# EAGLE design PCB1a (EAGLE 9.6.2)

## Sheet 1 of 3
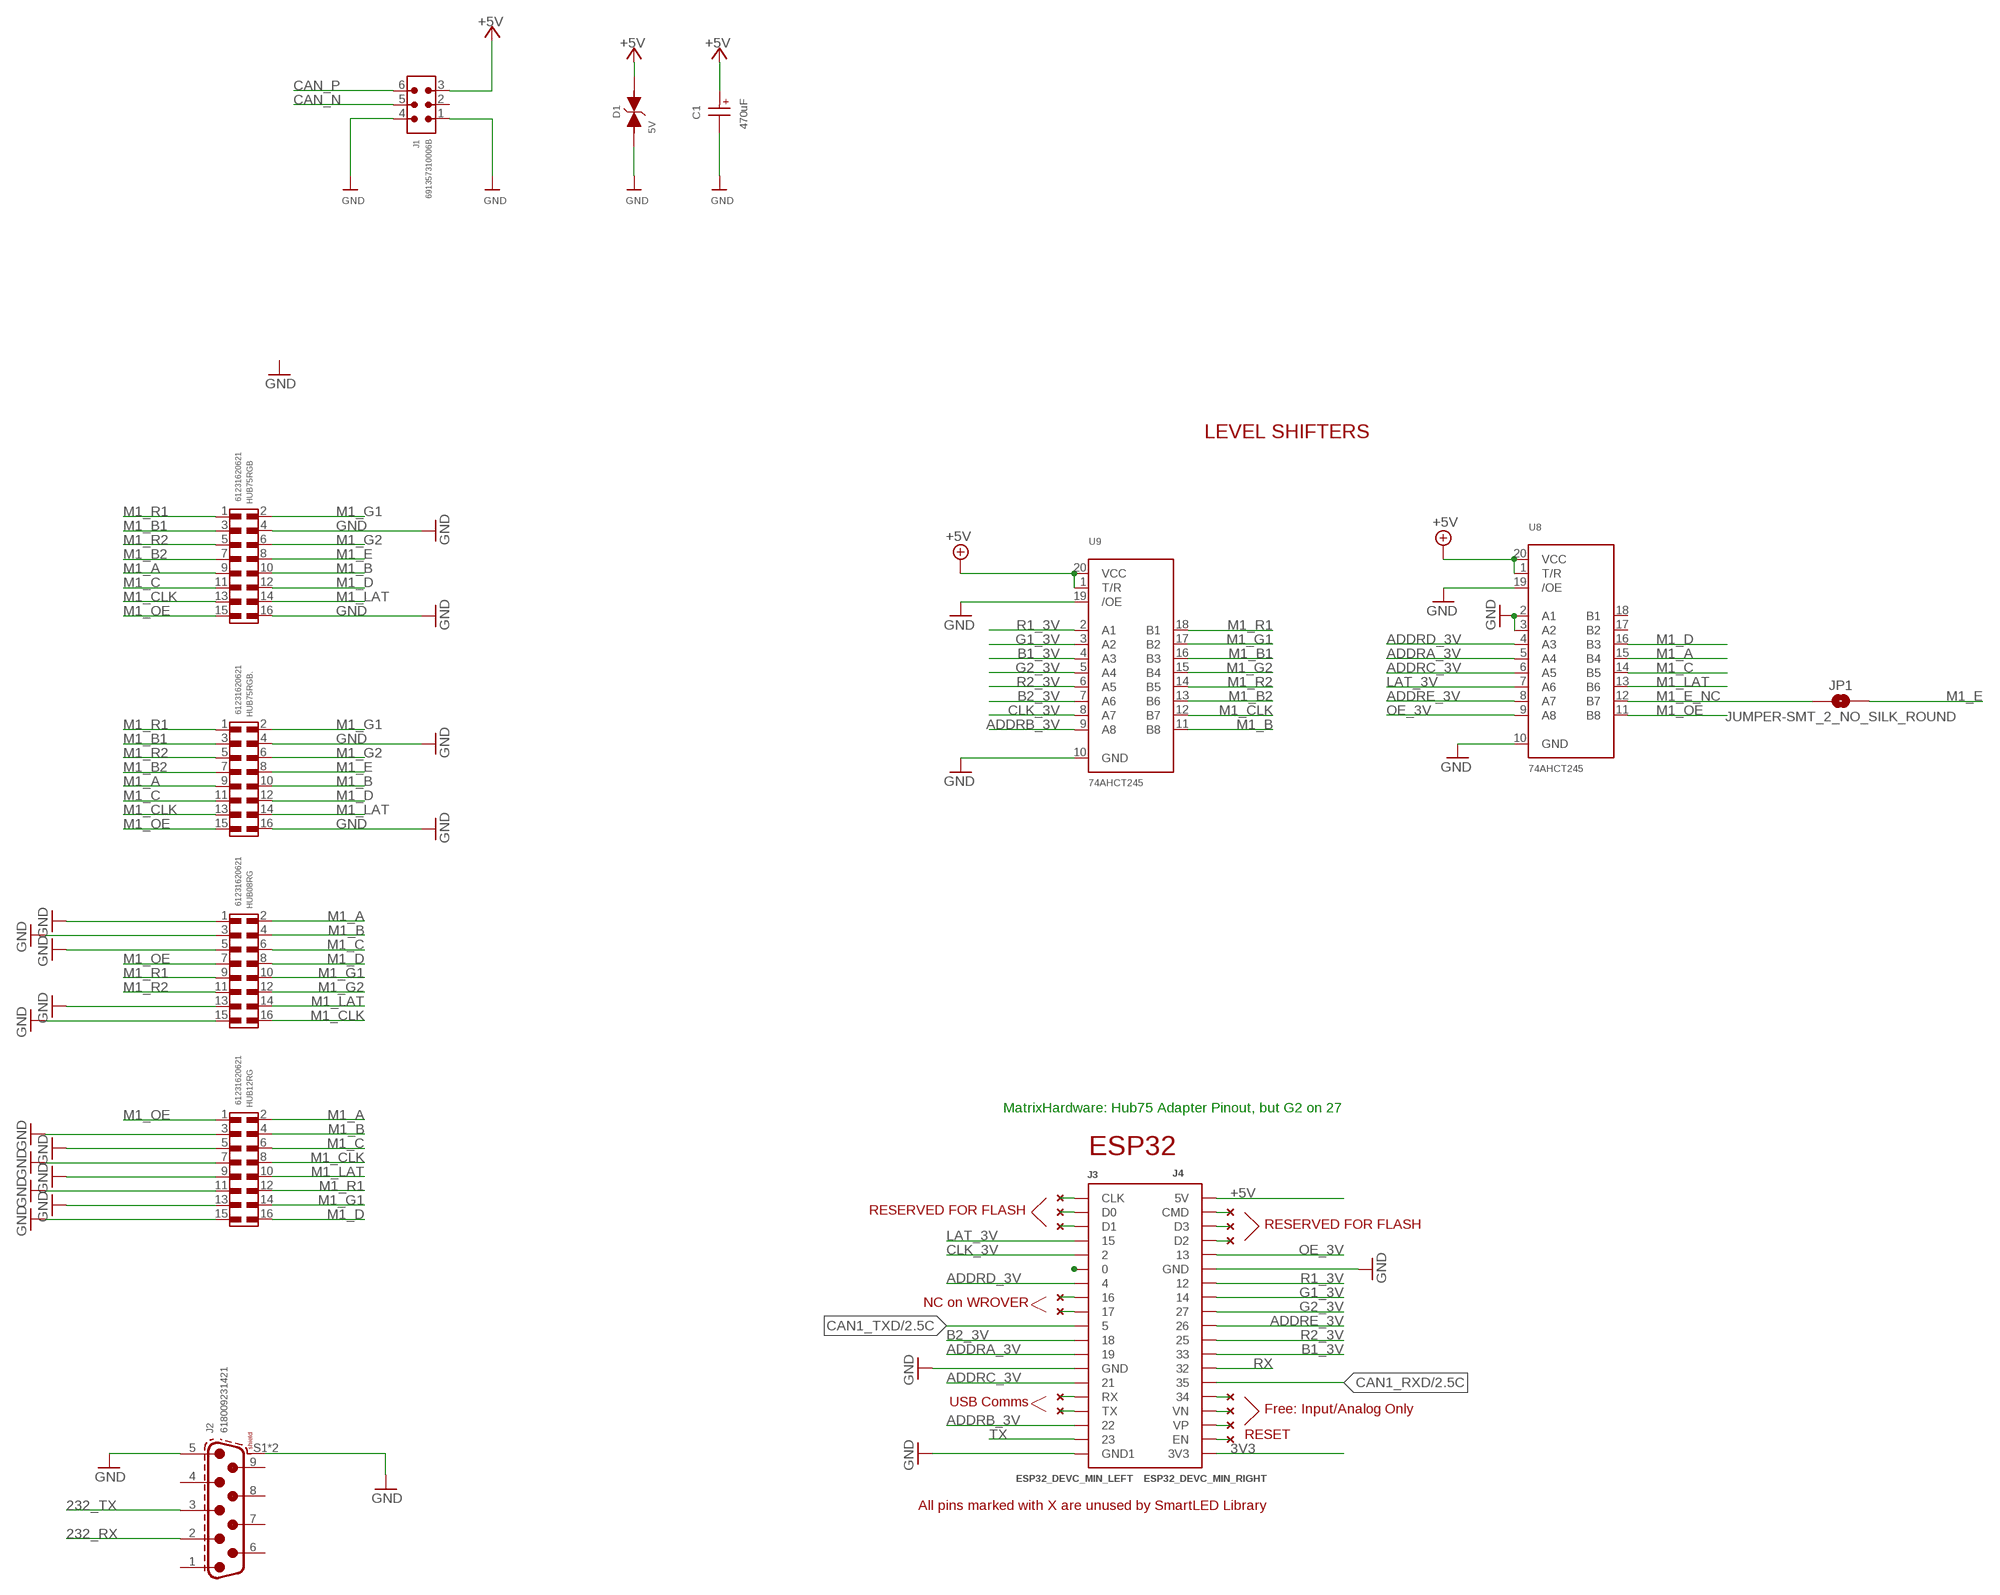
[diagram p0: schematic, sheet 1]

### Parts
C1  470uF  WCAP-AS5H_10X10.5_865230357008  [WCAP-AS5H_10X10.5(DXL)]
D1  5V  WE-TVSP_DO-214AB_3000W_BI_824551500  [WE-TVSP_DO-214AB_BIDIRECTIONAL]
HUB08RG  61231620621  6123XX20621_61231620621  [61231620621]
HUB12RG  61231620621  6123XX20621_61231620621  [61231620621]
HUB75RGB  61231620621  6123XX20621_61231620621  [61231620621]
HUB75RGB.  61231620621  6123XX20621_61231620621  [61231620621]
J1  691357310006B  [691357310006B]
J2  618009231421  6180XX231421_618009231421  [618009231421]
J3  ESP32_DEVC_MIN_LEFT  [ESP32_DEVC_DUAL_HEADER_BOT_MOUNT_LEFT]
J4  ESP32_DEVC_MIN_RIGHT  [ESP32_DEVC_DUAL_HEADER_BOT_MOUNT_RIGHT]
JP1  JUMPER-SMT_2_NO_SILK_ROUND  [SMT-JUMPER_2_NO_SILK_ROUND]
U8  74AHCT245  74LCX245_TSSOP20  [TSSOP20]
U9  74AHCT245  74LCX245_TSSOP20  [TSSOP20]
U$2  NC  (no package)
U$3  NC  (no package)
U$4  NC  (no package)
U$5  NC  (no package)
U$6  NC  (no package)
U$7  NC  (no package)
U$8  NC  (no package)
U$9  NC  (no package)
U$10  NC  (no package)
U$11  NC  (no package)
U$13  NC  (no package)
U$15  NC  (no package)
U$16  NC  (no package)
U$17  NC  (no package)

### Nets
3V3 [power]: J4.3V3A(3V3) J4.3V3B(3V3)
232_RX: J2.2 ; also sheet 3
232_TX: J2.3 ; also sheet 3
+5V [usbvcc]: C1.1(+) D1.2 J1.3 J4.5V_A(5V) J4.5V_B(5V) U8.1(T/R) U8.20(VCC) U9.1(T/R) U9.20(VCC) ; also sheet 2
ADDRA_3V: J3.19A_A J3.19B_B U8.5(A4)
ADDRB_3V: J3.22A J3.22B U9.9(A8)
ADDRC_3V: J3.21A J3.21B U8.6(A5)
ADDRD_3V: J3.4A J3.4B U8.4(A3)
ADDRE_3V: J4.26A J4.26B U8.8(A7)
B1_3V: J4.33A J4.33B U9.4(A3)
B2_3V: J3.18A_A J3.18B_B U9.7(A6)
CAN1_RXD: J4.35A J4.35B ; also sheet 2
CAN1_TXD: J3.5A J3.5B ; also sheet 2
CAN_N: J1.5 ; also sheet 2
CAN_P: J1.6 ; also sheet 2
CLK_3V: J3.2A J3.2B U9.8(A7)
G1_3V: J4.14A_A J4.14B_B U9.3(A2)
G2_3V: J4.27A J4.27B U9.5(A4)
GND: C1.2(-) D1.1 HUB08RG.1 HUB08RG.3 HUB08RG.5 HUB08RG.13 HUB08RG.15 HUB12RG.3 HUB12RG.5 HUB12RG.7 HUB12RG.9 HUB12RG.11 HUB12RG.13 HUB12RG.15 HUB75RGB.4 HUB75RGB.16 HUB75RGB..4 HUB75RGB..16 J1.1 J1.4 J2.5 J2.S1(SHIELD) J2.S2(SHIELD) J3.GND1A(GND1) J3.GND1B(GND1) J3.GNDA(GND) J3.GNDB(GND) J4.GNDA(GND) J4.GNDB(GND) U8.2(A1) U8.3(A2) U8.10(GND) U8.19(/OE) U9.10(GND) U9.19(/OE) ; also sheet 2,3
LAT_3V: J3.15A_A J3.15B_B U8.7(A6)
M1_A: HUB08RG.2 HUB12RG.2 HUB75RGB.9 HUB75RGB..9 U8.15(B4)
M1_B: HUB08RG.4 HUB12RG.4 HUB75RGB.10 HUB75RGB..10 U9.11(B8)
M1_B1: HUB75RGB.3 HUB75RGB..3 U9.16(B3)
M1_B2: HUB75RGB.7 HUB75RGB..7 U9.13(B6)
M1_C: HUB08RG.6 HUB12RG.6 HUB75RGB.11 HUB75RGB..11 U8.14(B5)
M1_CLK: HUB08RG.16 HUB12RG.8 HUB75RGB.13 HUB75RGB..13 U9.12(B7)
M1_D: HUB08RG.8 HUB12RG.16 HUB75RGB.12 HUB75RGB..12 U8.16(B3)
M1_E: HUB75RGB.8 HUB75RGB..8 JP1.2
M1_E_NC: JP1.1 U8.12(B7)
M1_G1: HUB08RG.10 HUB12RG.14 HUB75RGB.2 HUB75RGB..2 U9.17(B2)
M1_G2: HUB08RG.12 HUB75RGB.6 HUB75RGB..6 U9.15(B4)
M1_LAT: HUB08RG.14 HUB12RG.10 HUB75RGB.14 HUB75RGB..14 U8.13(B6)
M1_OE: HUB08RG.7 HUB12RG.1 HUB75RGB.15 HUB75RGB..15 U8.11(B8)
M1_R1: HUB08RG.9 HUB12RG.12 HUB75RGB.1 HUB75RGB..1 U9.18(B1)
M1_R2: HUB08RG.11 HUB75RGB.5 HUB75RGB..5 U9.14(B5)
N$1: J3.0A J3.0B
N$2: J4.CMD_A(CMD) J4.CMD_B(CMD) U$2.P$1
N$3: J4.D3_A(D3) J4.D3_B(D3) U$3.P$1
N$5: J4.D2A(D2) J4.D2B(D2) U$4.P$1
N$6: J3.CLKA(CLK) J3.CLKB(CLK) U$5.P$1
N$7: J3.D0A(D0) J3.D0B(D0) U$6.P$1
N$8: J3.D1A(D1) J3.D1B(D1) U$7.P$1
N$9: J4.VNA(VN) J4.VNB(VN) U$8.P$1
N$10: J4.VPA(VP) J4.VPB(VP) U$9.P$1
N$11: J4.34A J4.34B U$10.P$1
N$13: J4.ENA(EN) J4.ENB(EN) U$11.P$1
N$14: J3.TXA(TX) J3.TXB(TX) U$13.P$1
N$15: J3.RXA(RX) J3.RXB(RX) U$15.P$1
N$16: J3.17A_A J3.17B_B U$16.P$1
N$17: J3.16_B J3.16A_A U$17.P$1
OE_3V: J4.13A_A J4.13B_B U8.9(A8)
R1_3V: J4.12A J4.12B U9.2(A1)
R2_3V: J4.25A J4.25B U9.6(A5)
RX: J4.32A J4.32B ; also sheet 3
TX: J3.23A J3.23B ; also sheet 3
Unconnected: J1.2 J2.1 J2.4 J2.6 J2.7 J2.8 J2.9 U8.17(B2) U8.18(B1)

### Notes on the sheet
- LEVEL SHIFTERS
- MatrixHardware: Hub75 Adapter Pinout, but G2 on 27
- ESP32
- RESERVED FOR FLASH
- RESERVED FOR FLASH
- NC on WROVER
- USB Comms
- Free: Input/Analog Only
- RESET
- All pins marked with X are unused by SmartLED Library

## Sheet 2 of 3
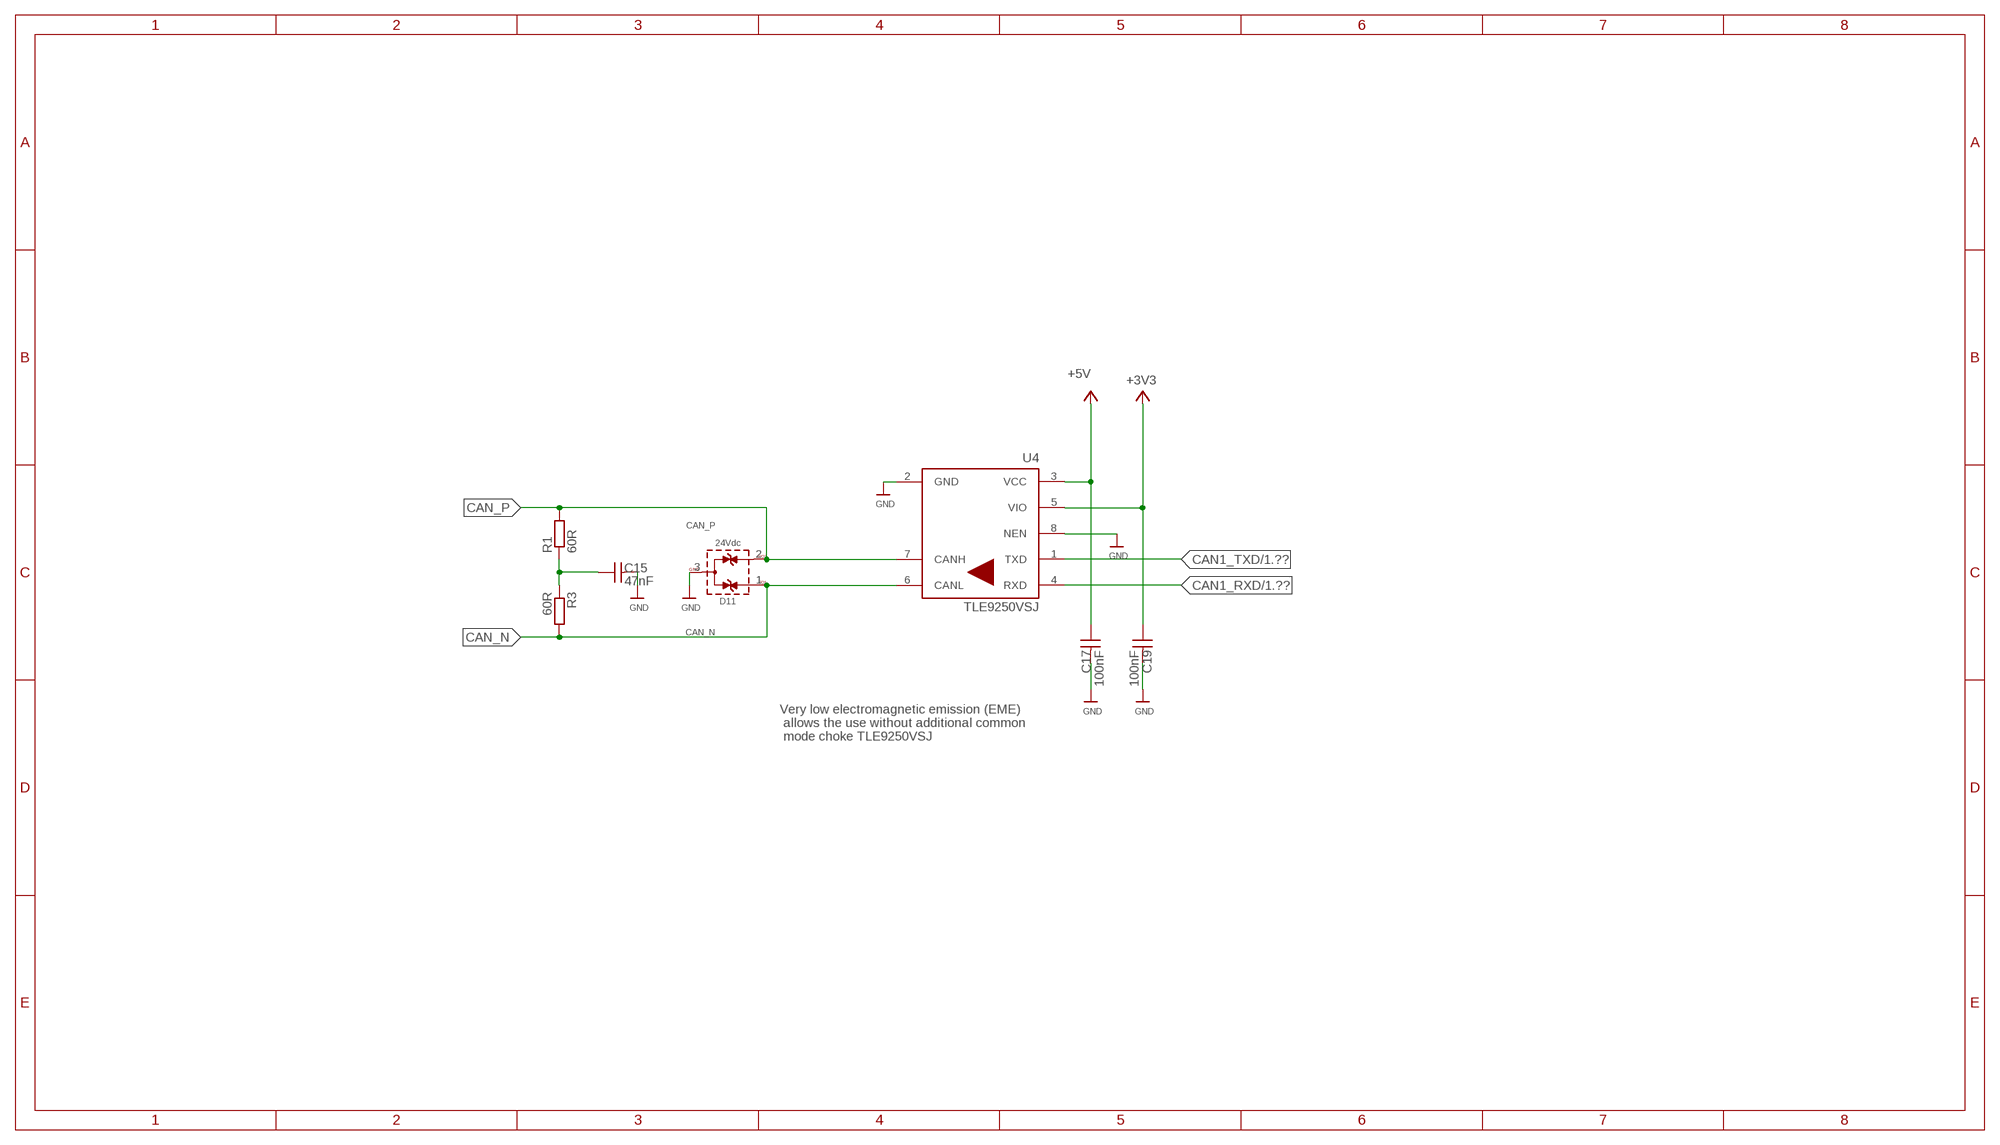
[diagram p1: schematic, sheet 2]

### Parts
C15  47nF  WCAP-CSGP_0805_H0.8_885012207096_50V(DC)_R  [WCAP-CSGP_0805_H0.8_R]
C17  100nF  WCAP-CSGP_0805_H0.8_885012207098_50V(DC)_R  [WCAP-CSGP_0805_H0.8_R]
C19  100nF  WCAP-CSGP_0805_H0.8_885012207098_50V(DC)_R  [WCAP-CSGP_0805_H0.8_R]
D11  24Vdc  WE-TVS_SOT23-3L_824094024  [WE-TVS_SOT23-3L]
R1  60R  R-EU_R0805  [R0805]
R3  60R  R-EU_R0805  [R0805]
U4  TLE9250VSJ  [SOIC127P602X173-8N-V]

### Nets
+3V3: C19.1 U4.5(VIO)
+5V [usbvcc]: C17.1 U4.3(VCC) ; also sheet 1
CAN1_RXD: U4.4(RXD) ; also sheet 1
CAN1_TXD: U4.1(TXD) ; also sheet 1
CAN_N: D11.1(I/O1) R3.2 U4.6(CANL) ; also sheet 1
CAN_P: D11.2(I/O2) R1.2 U4.7(CANH) ; also sheet 1
GND: C15.2 C17.2 C19.2 D11.3(GND) U4.2(GND) U4.8(NEN) ; also sheet 1,3
N$20: C15.1 R1.1 R3.1

### Notes on the sheet
- Very low electromagnetic emission (EME)
   allows the use without additional common
   mode choke TLE9250VSJ

## Sheet 3 of 3
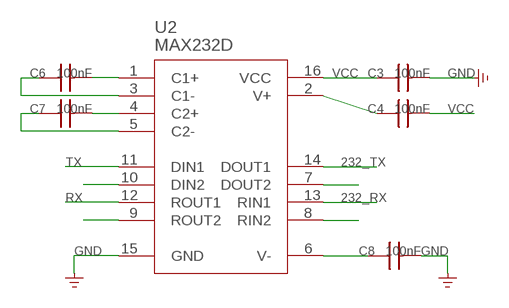
[diagram p2: schematic, sheet 3]

### Parts
C3  100nF  WCAP-CSGP_0805_H0.8_885012207098_50V(DC)_R  [WCAP-CSGP_0805_H0.8_R]
C4  100nF  WCAP-CSGP_0805_H0.8_885012207098_50V(DC)_R  [WCAP-CSGP_0805_H0.8_R]
C6  100nF  WCAP-CSGP_0805_H0.8_885012207098_50V(DC)_R  [WCAP-CSGP_0805_H0.8_R]
C7  100nF  WCAP-CSGP_0805_H0.8_885012207098_50V(DC)_R  [WCAP-CSGP_0805_H0.8_R]
C8  100nF  WCAP-CSGP_0805_H0.8_885012207098_50V(DC)_R  [WCAP-CSGP_0805_H0.8_R]
U2  MAX232D  MAX3232-SOIC16  [SOIC16]

### Nets
232_RX: U2.13(RIN1) ; also sheet 1
232_TX: U2.14(DOUT1) ; also sheet 1
GND: C3.2 C8.2 U2.15(GND) ; also sheet 1,2
N$33: C6.2 U2.1(C1+)
N$34: C6.1 U2.3(C1-)
N$35: C7.2 U2.4(C2+)
N$36: C7.1 U2.5(C2-)
N$37: C4.1 U2.2(V+)
N$38: C8.1 U2.6(V-)
N$39: U2.9(ROUT2)
N$40: U2.10(DIN2)
N$46: U2.7(DOUT2)
N$47: U2.8(RIN2)
RX: U2.12(ROUT1) ; also sheet 1
TX: U2.11(DIN1) ; also sheet 1
VCC: C3.1 C4.2 U2.16(VCC)

## Library data of the parts
C1 = Wurth_Capacitors_WCAP-AS5H:WCAP-AS5H_10X10.5: WCAP-AS5H Aluminium Electrolytic Capacitors Long Life +105 °C Characteristics Long life product series Mounting style: V-Chip SMT Capacitance range: 0.1 µF ‒ 1000 µF Capacitance tolerance: ±20 % Voltage range (UR): 6.3 ‒ 50 V(DC) Operating temperature: -40 °C up to +105 °C Endurance: 5000 h @ +105 °C Dimensions (DxL) in mm: 4.0 x 5.5 up to 10.0 x 10.5 Recommended soldering: Reflow soldering Applications Long life applications (industry, medical) Input and output capacitor for switched-mode power supply Filtering Smoothing e.g. DC/DC converter, AC/DC converter, satellite receiver, control panel <https://www.we-online.com/catalog/media/o55801v209%20Family_WCAP-AS5H.jpg> Details see: www.we-online.com/catalog/WCAP-AS5H <www.we-online.com/catalog/WCAP-AS5H/?utm_source=eagle_model&utm_medium=description_link&utm_campaign=eisos_eagle> Updated by Ella Wu 2022-07-27 2022(C) Würth Elektronik; DATASHEET-URL: https://www.we-online.com/redexpert/spec/865230357008?ae; DF: 22%; DIAMETER: 10mm; ENDURANCE: 5000h; HEIGHT: 10.5mm; I-LEAK: 75.2uA; I-RIPPLE: 320mA; OPERATING-TEMPERATURE: -40 °C up to +105 °C; PART-NUMBER: 865230357008; TECHNICAL-REFERENCE: ASDF105471M016DVCTEE000; VR: 16V(DC)
C3 C4 C6-C8 C17 C19 = Wurth_Capacitors_WCAP-CSGP:WCAP-CSGP_0805_H0.8: WCAP-CSGP MLCCs 0805 Characteristics General purpose product series High performance ceramic High electrical precision and stability ceramic especially for NP0 Minimal aging especially for NP0 Mounting style: SMT-Chip Ceramic: NP0 (Class I), X5R (Class II), X7R (Class II) Temperature coefficient: ±30 ppm/°C; ±0.54 % for NP0 ±15 % for X5R and X7R Operating temperature: -55 °C up to + 125 °C for NP0 and X7R -55 °C up to + 85 °C for X5R Termination: Cu/Ni/Sn Recommended soldering: Reflow soldering Wave soldering for size 0603 Wave soldering for size 0805 (only valid for the thickness ≤0.85 mm) Applications Temperature compensation (NP0) Coupling Decoupling Bypass Smoothing Filtering Resonant circuit <https://www.we-online.com/catalog/media/o177837v209%20MLCC_GRP_all.jpg> Details see: https://www.we-online.com/catalog/en/pbs/capacitors/multilayer_ceramic_chip_capacitors/mlcc_general_purpose Updated by Ella Wu 2022-02-15 2022(C) Würth Elektronik; CERAMIC-TYPE: X7R Class II; DATASHEET-URL: https://www.we-online.com/redexpert/spec/885012207098?ae; DF: 2.5%; HEIGHT: 0.8mm; MOUNT: SMT; OPERATING-TEMPERATURE: -55 up to +125 °C; PART-NUMBER: 885012207098; QMIN: -; RISO: 5GOhm; SIZE: 0805; TECHNICAL-REFERENCE: X7R0805104K050DFCT10000; VR: 50V(DC)
C15 = Wurth_Capacitors_WCAP-CSGP:WCAP-CSGP_0805_H0.8: WCAP-CSGP MLCCs 0805 Characteristics General purpose product series High performance ceramic High electrical precision and stability ceramic especially for NP0 Minimal aging especially for NP0 Mounting style: SMT-Chip Ceramic: NP0 (Class I), X5R (Class II), X7R (Class II) Temperature coefficient: ±30 ppm/°C; ±0.54 % for NP0 ±15 % for X5R and X7R Operating temperature: -55 °C up to + 125 °C for NP0 and X7R -55 °C up to + 85 °C for X5R Termination: Cu/Ni/Sn Recommended soldering: Reflow soldering Wave soldering for size 0603 Wave soldering for size 0805 (only valid for the thickness ≤0.85 mm) Applications Temperature compensation (NP0) Coupling Decoupling Bypass Smoothing Filtering Resonant circuit <https://www.we-online.com/catalog/media/o177837v209%20MLCC_GRP_all.jpg> Details see: https://www.we-online.com/catalog/en/pbs/capacitors/multilayer_ceramic_chip_capacitors/mlcc_general_purpose Updated by Ella Wu 2022-02-15 2022(C) Würth Elektronik; CERAMIC-TYPE: X7R Class II; DATASHEET-URL: https://www.we-online.com/redexpert/spec/885012207096?ae; DF: 2.5%; HEIGHT: 0.8mm; MOUNT: SMT; OPERATING-TEMPERATURE: -55 up to +125 °C; PART-NUMBER: 885012207096; QMIN: -; RISO: 10GOhm; SIZE: 0805; TECHNICAL-REFERENCE: X7R0805473K050DFCT10000; VR: 50V(DC)
D1 = Wurth_EMC Components_WE-TVSP:WE-TVSP_DO-214AB_3000W_BI: WE-TVSP Power TVS Diode Characteristics Low Profile Package Glass passivated Juction Excellent clamping capability Fast response time MSL Level 1, per J-STD-020 Classification of the plastic case: UL 94 V-0 Safety certification UL 497B, E478010 Identical design: - DO-214AC = SMAJ - DO-214AA = SMBJ - DO-214AB = SMCJ/SMDJ Applications Ideal to protect the I/O Interfaces, Bus Voltage and other circuits of sensetive electronic equipment against voltage transiensts <https://www.we-online.com/catalog/media/o55793v209%20WE-TVSP_600W-3000W_D0214AA_4C.jpg> Details see: https://www.we-online.com/catalog/en/WE-TVSP/ Updated by Ella Wu 2020-07-20 2020 (C) Würth Elektronik; DATASHEET-URL: https://www.we-online.com/catalog/datasheet/824551500.pdf; IPEAK: 326.1A; MOUNT: SMT; PART-NUMBER: 824551500; PDISS: 3000W; VBR: 6.7V; VCLAMP: 9.2V
D11 = Wurth_EMC Components_WE-TVS:WE-TVS_SOT23-3L_824094024: WE-TVS TVS Diode – Standard Series Characteristics Fast turn-on Low clamping voltage High ESD withstand voltage Uni- or bidirectional protection Small package Epoxy flame resistant UL94 V-0 Applications DC power supply USB Power Delivery (PD) Headsets and accessories PDAs Digital cameras MP3-Player Touch Panels Notebooks ESD, EFT and Surge Protection ESD protection in accordance with EN 61000-4-2 – 8 kV contact discharge – 15 kV air discharge <https://www.we-online.com/catalog/media/o106433v209%20Family_WE-TVS_Standard.jpg> Details see: https://www.we-online.com/catalog/en/WE-TVS Created by Ella Wu 2021-12-15 2021 (C) Wurth Elektronik; C-CH: 38pF; CHANNELS: 2; DATASHEET-URL: https://www.we-online.com/catalog/datasheet/824094024.pdf; IPEAK: 6A; MOUNT: SMT; PART-NUMBER: 824094024; VBR: 26.2V
HUB08RG HUB12RG HUB75RGB HUB75RGB. = Wurth_Connectors_WR-BHD:6123XX20621_61231620621: WR-BHD 2.54 mm Male SMT Box Header Material Properties: Insulator Material PA 9T; PA9T Insulator Flammability Rating UL94 V-0 Color Black Contact Material Copper Alloy Contact Plating Gold Contact Type Stamped General Information Operating Temperature -40 up to +125 °C Compliance RoHS Working Voltage 250 V (AC) Withstanding Voltage 500 V (AC) Contact Resistance 20 mΩ RISO 1000 MΩ Pitch 2.54 mm Gender Male Certification UL Approval E323964 Packaging Properties Packaging Tape and Reel with Cap <https://www.we-online.com/components/media/o32919v209%20Family_WR-BHD_612xxx20621.jpg> Details see: www.we-online.com/en/components/products/BHD_2_54_SMT_MALE_BOX_HEADER_6120XX20621 <www.we-online.com/catalog/BHD_2_54_SMT_MALE_BOX_HEADER_6120XX20621/?utm_source=eagle_model&utm_medium=description_link&utm_campaign=eisos_eagle> Updated by Ella Wu 2022-09-06 2022 (C) Würth Elektronik; CONTACT-RESISTANCE: 20mOhm; DATASHEET-URL: https://www.we-online.com/redexpert/spec/61231620621?ae; GENDER: Male; IR: 3A; LENGTH: 27.94mm; MOUNT: SMT; PACKAGING: Tape and Reel with Cap; PART-NUMBER: 61231620621; PINS: 16; PITCH: 2.54mm; TYPE: Straight; WORKING-VOLTAGE: 250V(AC)
J1 = Wurth_Connectors_WR-TBL Pluggable Connector:691357310006B: WR-TBL Serie 357B - 3.81 mm Double Level Horizontal Male PCB Header with Flanges KIND PROPERTIES Pitch 3.81 mm MATERIAL PROPERTIES Insulator Material PA66 Insulator Flammability Rating UL94 V-0 Contact Material Brass Contact Plating Tin GENERAL INFORMATION Operating Temperature -40 up to +105 °C Compliance RoHS ELECTRICAL PROPERTIES IR UL 10 A Working Voltage [UL] 300 V (AC) Withstanding Voltage [cULus] 2000 V (AC) Contact Resistance [cULus] 20 mΩ CERTIFICATION cULus Approval E315414 <https://www.we-online.com/catalog/media/o60711v209%20Family_WR-TBL_Serie_357B_6913573100xxB.jpg> Details see: https://www.we-online.com/catalog/en/TBL_3_81_357B_DOUBLE_LEVEL_HORIZONTAL_MALE_PCB_HEADER_W_FLANGES_6913573100XXB/ Updated by Ella Wu 2019-12-23 2022(C) Wurth Elektronik; DATASHEET-URL: https://www.we-online.com/redexpert/spec/691357310006B?ae; IR-UL: 10A; MOUNT: THT; PART-NUMBER: 691357310006B; PINS: 6; PITCH: 3.81mm; TYPE: Double Level Horizontal; WORKING-VOLTAGE-UL: 300V (AC)
J2 = Wurth_Connectors_WR-DSUB:6180XX231421_618009231421: WR-DSUB 10.30 mm Male Angled PCB Connector w. Hex Screw Kind Properties Quality Class:3 as per CECC 75 301-802 Gender:Male Type:Angled Insulator Material:PBT Insulator Flammability Rating:UL94 V-0 Color:Black Contact Material:Copper Alloy Contact Plating:Selective Gold Contact Type:Stamped Shielding Material:Steel Shielding Plating:Nickel General Information Operating Temperature:-55 up to +105 °C Compliance:RoHS Electrical Properties IR1:3 A Working Voltage:125 V (AC) Withstanding Voltage:1000 V (AC) Contact Resistance:30 mΩ <https://www.we-online.com/catalog/media/o60849v209%20Family_I-O_DSUB_PCB_Male_w-screw_6180xx231421_pf2.jpg> Details see: https://www.we-online.com/en/components/products/DSUB_MALE_ANGLED_PCB_CONNECTOR_W_HEX_SCREW_10_30MM_6180XX231421 Updated by Ella Wu 2023-03-21 2023 (C) Würth Elektronik; DATASHEET-URL: https://www.we-online.com/redexpert/spec/618009231421?ae; GENDER: Male; PART-NUMBER: 618009231421; PINS: 9; TYPE: Angled; WE-NUMBER: 618009231421; WORKING-VOLTAGE: 125 V(AC)
J3 = eclibrary:ESP32_DEVC_MIN_LEFT
J4 = eclibrary:ESP32_DEVC_MIN_RIGHT
JP1 = SparkFun-Jumpers:JUMPER-SMT_2_NO: Normally open jumper This jumper has two pads in close proximity to each other. Apply solder to close the connection. Round pads are easier to solder for beginners, but are a lot larger. SparkFun Product that uses the round pads: SparkFun EL Sequencer <https://www.sparkfun.com/products/12781>
R1 R3 = resistor:R-EU_: RESISTOR, European symbol
U2 = IC:MAX3232
U4 = TLE9250VSJ:TLE9250VSJ: TLE9250VSJ SOIC127P602X173-8N-V High Speed CAN FD Transceiver; ARTIKEL_NR: 545599
U8 U9 = microbuilder:74LCX245: 74LCX245MTC - 5.0V Tolerant Bi-Directional Buffer Can be used to interface 5.0V logic to 2.5 or 3.3V devices Digikey: 74LCX245MTCXTR-ND Mouser: 512-74LCX245MTCX
U$2-U$11 U$13 U$15-U$17 = eclibrary:NC

## Net classes
1 power: width 0.305 mm
2 lowpower: width 0.305 mm, drill 0.483 mm

## Board
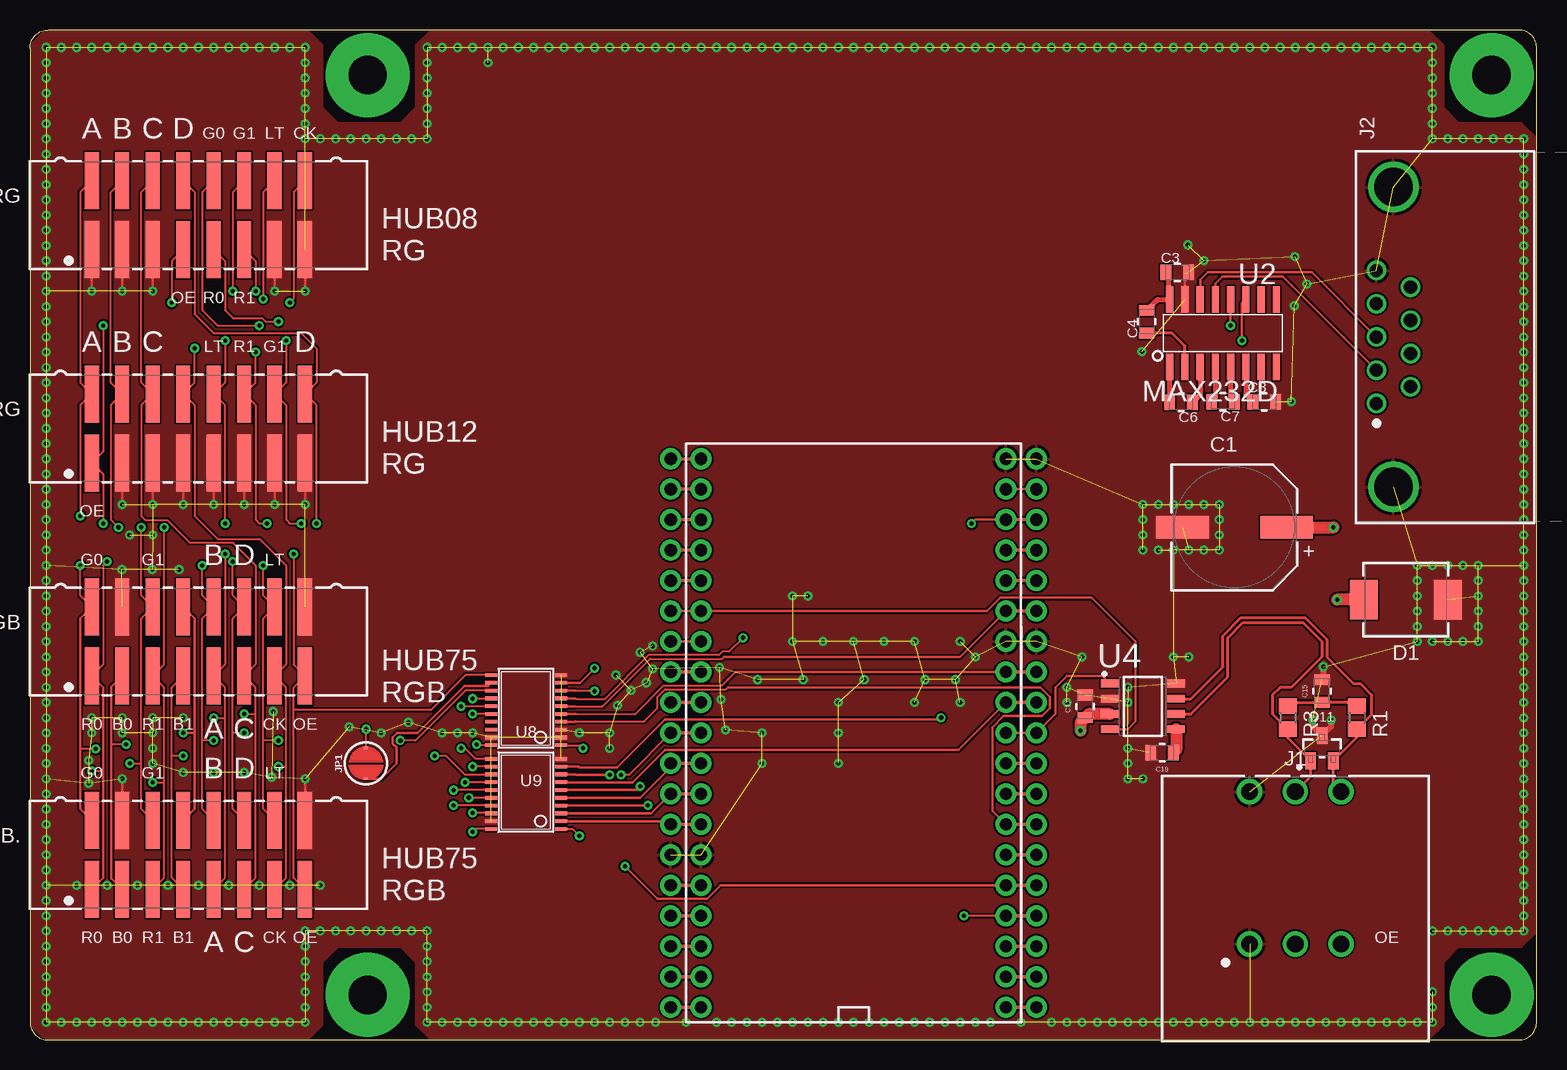
[diagram p3: board, top side]
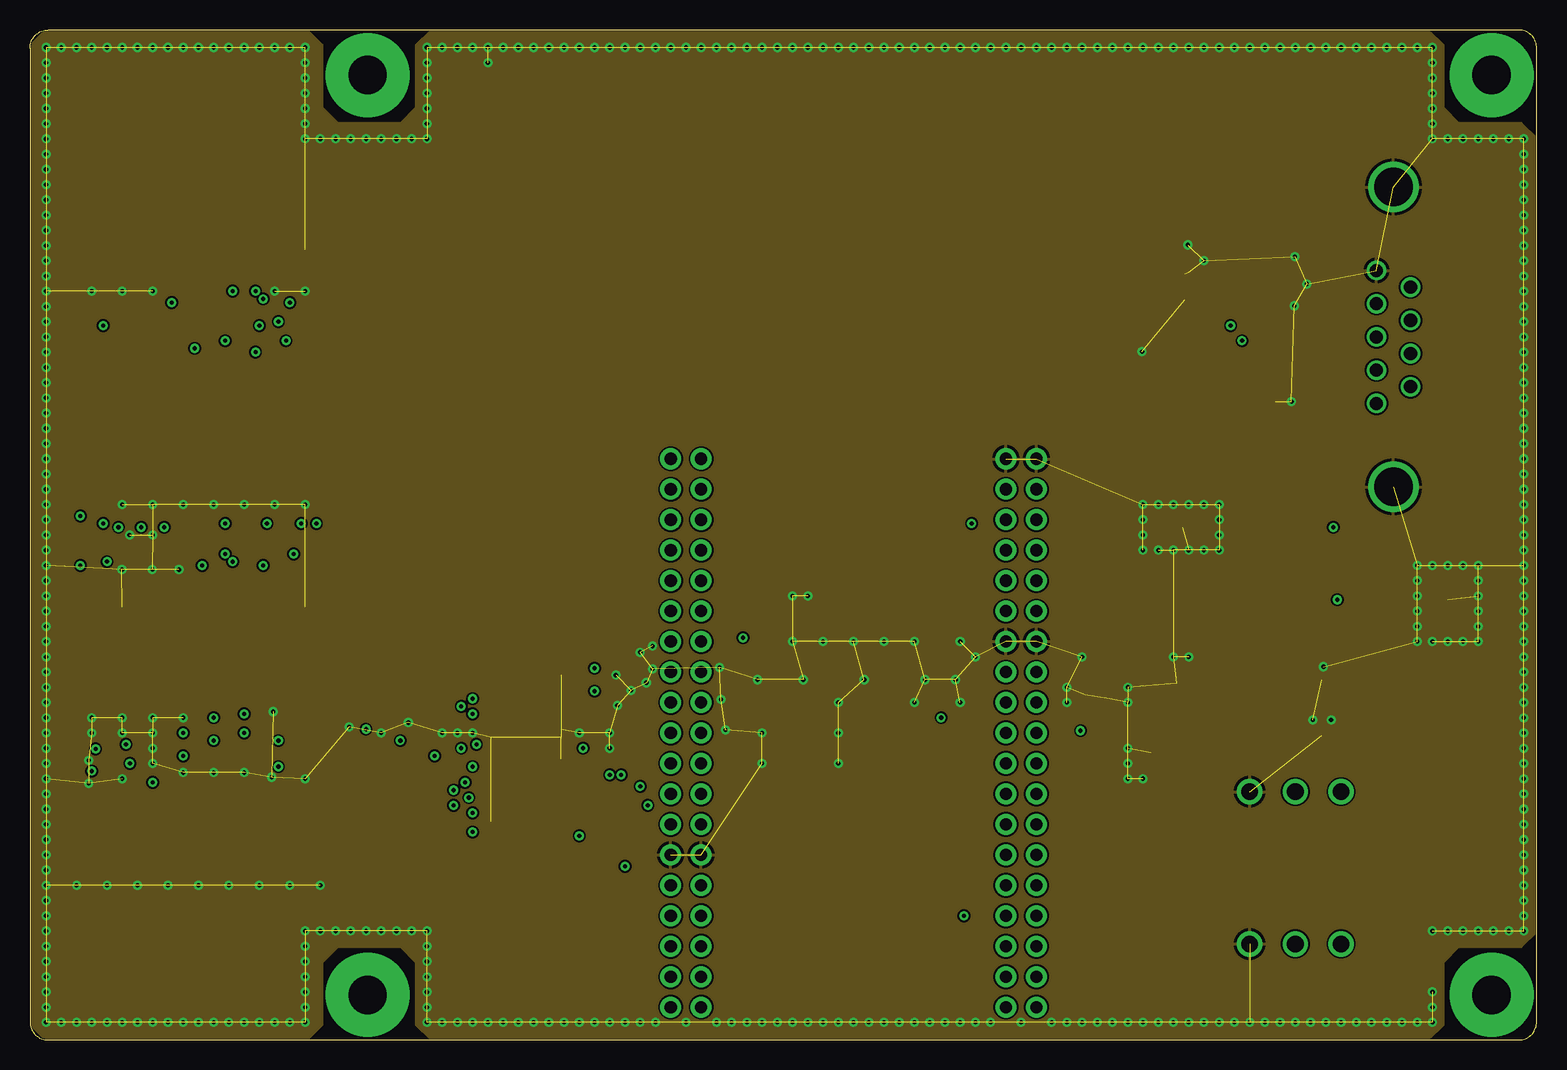
[diagram p4: board, inner layer Route2]
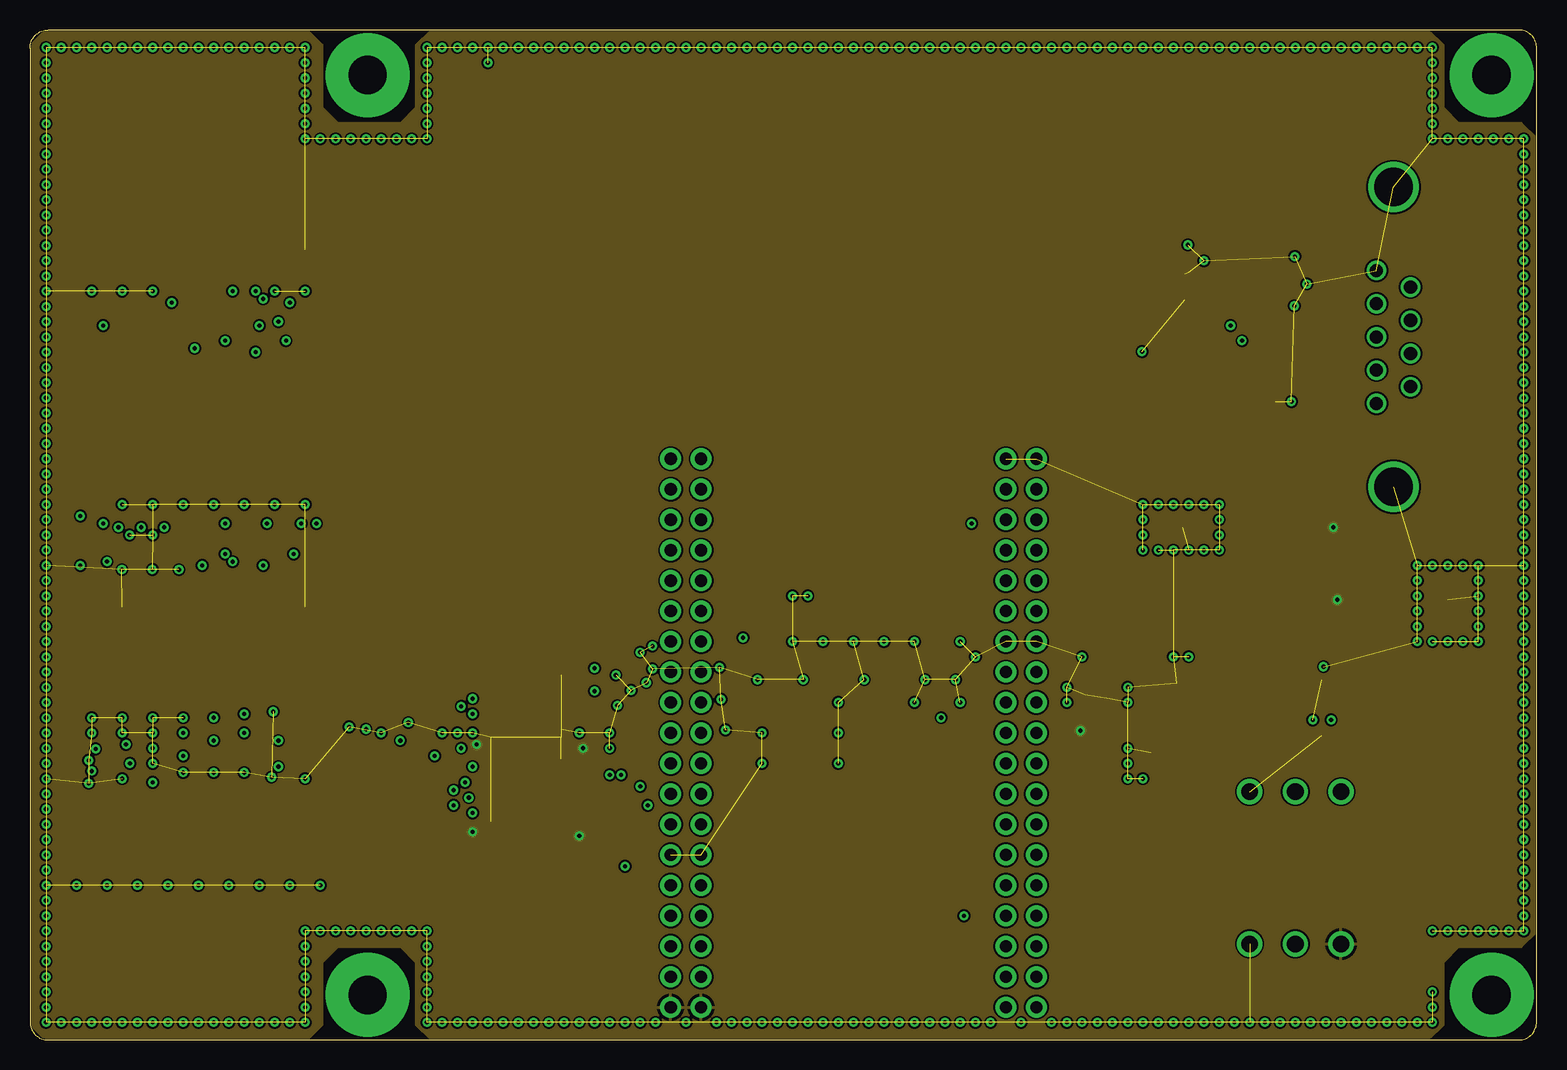
[diagram p5: board, inner layer Route15]
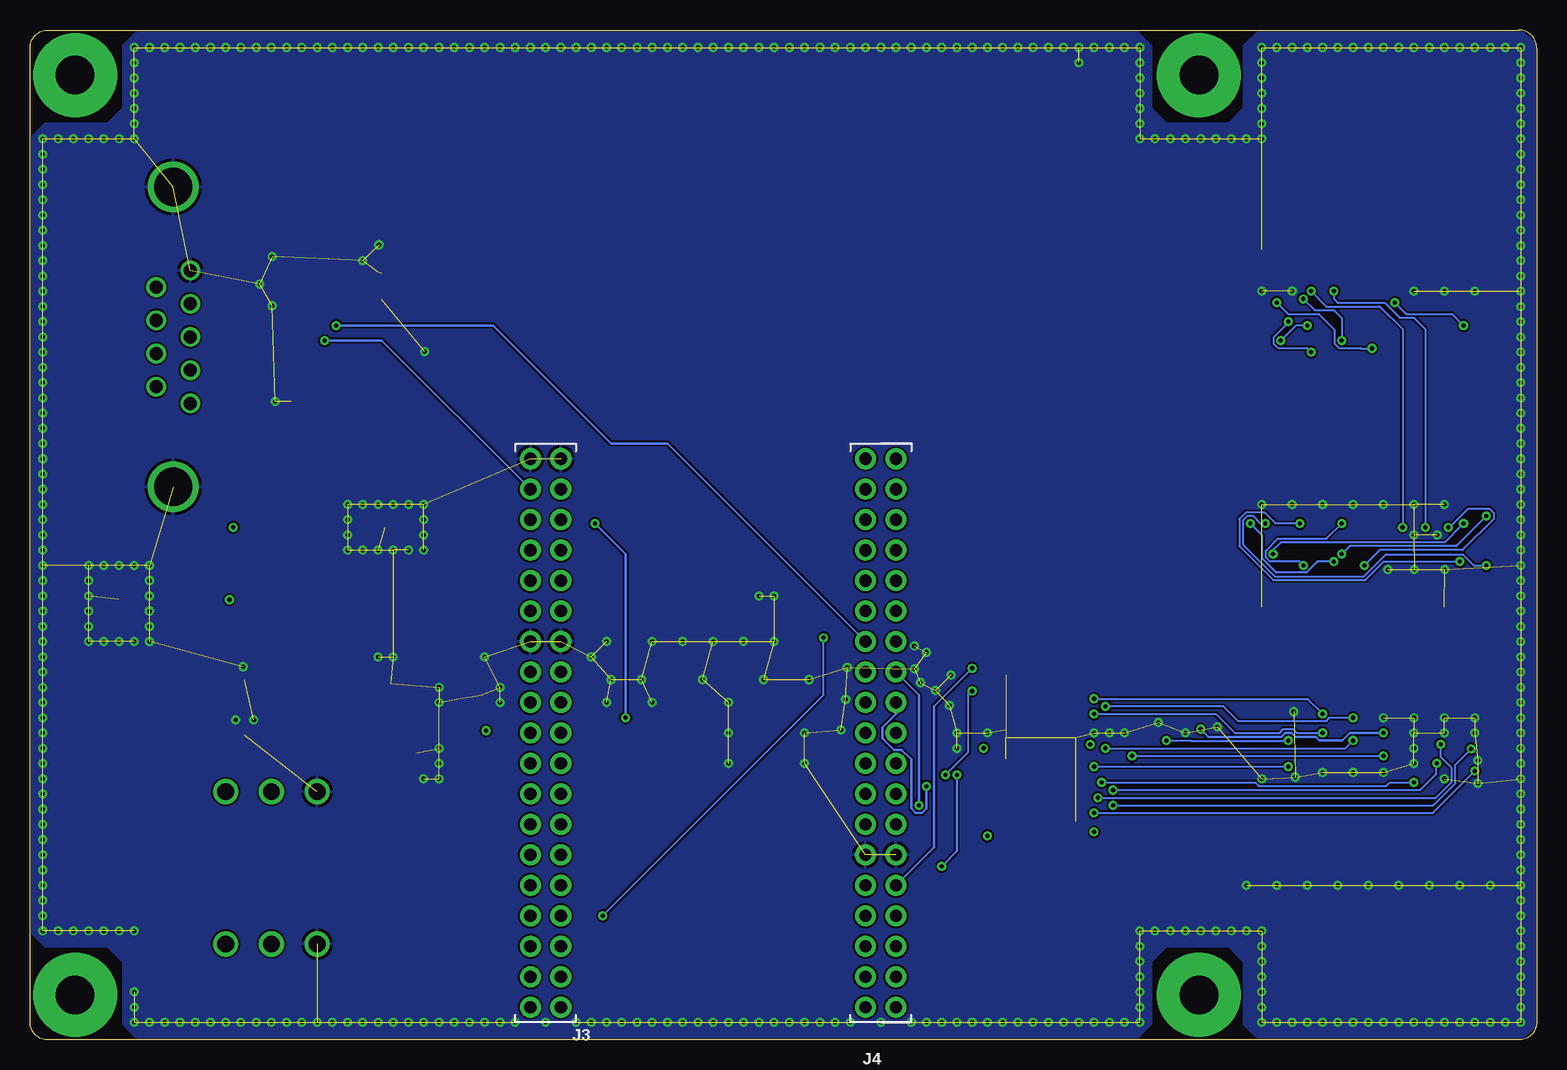
[diagram p6: board, bottom side, seen from below]

Size 125.6 x 84.2 mm. Coordinates in mm from the lower left corner, seen from the top.
Outline: 0,82.7 0,1.5 arc90 1.5,0 124.1,0 arc90 125.6,1.5 125.6,82.7 arc90 124.1,84.2 1.5,84.2 arc90 0,82.7
Copper layers (1+2*15+16): Top 0.035mm / dielectric 0.36mm / Route2 0.035mm / dielectric 0.71mm / Route15 0.035mm / dielectric 0.36mm / Bottom 0.035mm
Design rules "default *": minimum track width 6mil, minimum drill 0.35mm, track to track 6mil, track to pad 6mil, pad to pad 6mil, via to via 6mil, smd to smd 6mil, copper to edge 3mil, drill to drill 6mil, minimum pad ring 10mil, minimum via ring 8mil, stop-mask expansion 4mil, vias tented up to drill 15mil, thermal gap 10mil

### Footprints (pad centres in the part's own frame; a part is rotated, then mirrored left to right if it is on the bottom)
WCAP-AS5H_10X10.5(DXL) = smd 4.4 x 1.9: 1 4.35,0; 2 -4.35,0
WCAP-CSGP_0805_H0.8_R = smd 0.9 x 1.3: 1 -0.95,0; 2 0.95,0
WE-TVSP_DO-214AB_BIDIRECTIONAL = smd 2.3 x 3.3: 1 -3.5,0; 2 3.5,0
WE-TVS_SOT23-3L = smd 0.9 x 1.4: 1 -0.95,-1.05; 2 0.95,-1.05; 3 0,1.05
61231620621 = smd 1.2 x 4.75: 1 -8.89,-2.875; 2 -8.89,2.875; 3 -6.35,-2.875; 4 -6.35,2.875; 5 -3.81,-2.875; 6 -3.81,2.875; 7 -1.27,-2.875; 8 -1.27,2.875; 9 1.27,-2.875; 10 1.27,2.875; 11 3.81,-2.875; 12 3.81,2.875; 13 6.35,-2.875; 14 6.35,2.875; 15 8.89,-2.875; 16 8.89,2.875
691357310006B = drill 1.4: 1 -3.81,-6.35; 2 0,-6.35; 3 3.81,-6.35; 4 -3.81,6.35; 5 0,6.35; 6 3.81,6.35
618009231421 = drill 1.09: 1 -5.54,8.715; 2 -2.77,8.715; 3 0,8.715; 4 2.77,8.715; 5 5.54,8.715; 6 -4.155,5.875; 7 -1.385,5.875; 8 1.385,5.875; 9 4.155,5.875 | drill 3.2: S1 -12.495,7.295; S2 12.495,7.295
ESP32_DEVC_DUAL_HEADER_BOT_MOUNT_LEFT = drill 1.016 pad 1.753: 0A 1.27,8.89; 0B -1.27,8.89; 2A 1.27,11.43; 2B -1.27,11.43; 4A 1.27,6.35; 4B -1.27,6.35; 5A 1.27,-1.27; 5B -1.27,-1.27; 15A_A 1.27,13.97; 15B_B -1.27,13.97; 16_B -1.27,3.81; 16A_A 1.27,3.81; 17A_A 1.27,1.27; 17B_B -1.27,1.27; 18A_A 1.27,-3.81; 18B_B -1.27,-3.81; 19A_A 1.27,-6.35; 19B_B -1.27,-6.35; 21A 1.27,-11.43; 21B -1.27,-11.43; 22A 1.27,-19.05; 22B -1.27,-19.05; 23A 1.27,-21.59; 23B -1.27,-21.59; CLKA 1.27,21.59; CLKB -1.27,21.59; D0A 1.27,19.05; D0B -1.27,19.05; D1A 1.27,16.51; D1B -1.27,16.51; GND1A 1.27,-24.13; GND1B -1.27,-24.13; GNDA 1.27,-8.89; GNDB -1.27,-8.89; RXA 1.27,-13.97; RXB -1.27,-13.97; TXA 1.27,-16.51; TXB -1.27,-16.51
ESP32_DEVC_DUAL_HEADER_BOT_MOUNT_RIGHT = drill 1.016 pad 1.753: 3V3A -1.27,-24.13; 3V3B 1.27,-24.13; 5V_A -1.27,21.59; 5V_B 1.27,21.59; 12A -1.27,6.35; 12B 1.27,6.35; 13A_A -1.27,11.43; 13B_B 1.27,11.43; 14A_A -1.27,3.81; 14B_B 1.27,3.81; 25A -1.27,-3.81; 25B 1.27,-3.81; 26A -1.27,-1.27; 26B 1.27,-1.27; 27A -1.27,1.27; 27B 1.27,1.27; 32A -1.27,-8.89; 32B 1.27,-8.89; 33A -1.27,-6.35; 33B 1.27,-6.35; 34A -1.27,-13.97; 34B 1.27,-13.97; 35A -1.27,-11.43; 35B 1.27,-11.43; CMD_A -1.27,19.05; CMD_B 1.27,19.05; D2A -1.27,13.97; D2B 1.27,13.97; D3_A -1.27,16.51; D3_B 1.27,16.51; ENA -1.27,-21.59; ENB 1.27,-21.59; GNDA -1.27,8.89; GNDB 1.27,8.89; VNA -1.27,-16.51; VNB 1.27,-16.51; VPA -1.27,-19.05; VPB 1.27,-19.05
SMT-JUMPER_2_NO_SILK_ROUND = smd 0.152 x 0.305: 1 -1.27,0; 2 1.27,0
R0805 = smd 1.3 x 1.5: 1 -0.95,0; 2 0.95,0
SOIC16 = smd 0.6 x 2.2: 1 -4.445,-2.8; 2 -3.175,-2.8; 3 -1.905,-2.8; 4 -0.635,-2.8; 5 0.635,-2.8; 6 1.905,-2.8; 7 3.175,-2.8; 8 4.445,-2.8; 9 4.445,2.8; 10 3.175,2.8; 11 1.905,2.8; 12 0.635,2.8; 13 -0.635,2.8; 14 -1.905,2.8; 15 -3.175,2.8; 16 -4.445,2.8
SOIC127P602X173-8N-V = smd 1.47 x 0.65: 1 -2.765,1.905; 2 -2.765,0.635; 3 -2.765,-0.635; 4 -2.765,-1.905; 5 2.765,-1.905; 6 2.765,-0.635; 7 2.765,0.635; 8 2.765,1.905
TSSOP20 = smd 0.305 x 0.991: 1 -2.925,-2.918; 2 -2.275,-2.918; 3 -1.625,-2.918; 4 -0.975,-2.918; 5 -0.325,-2.918; 6 0.325,-2.918; 7 0.975,-2.918; 8 1.625,-2.918; 9 2.275,-2.918; 10 2.925,-2.918; 11 2.925,2.918; 12 2.275,2.918; 13 1.625,2.918; 14 0.975,2.918; 15 0.325,2.918; 16 -0.325,2.918; 17 -0.975,2.918; 18 -1.625,2.918; 19 -2.275,2.918; 20 -2.925,2.918

### Placement (x,y rotation side)
C1  100.4,42.73 0 top
C3  95.64,64.01 0 top
C4  93.1,59.88 90 top
C6  95.95,53.15 180 top
C7  99.45,53.21 180 top
C8  102.88,53.21 0 top
C15  107.7,29.08 90 top
C17  87.95,27.81 90 top
C19  94.37,23.94 180 top
D1  114.69,36.7 180 top
D11  107.7,24.32 0 top
HUB08RG  14.04,68.77 0 top
HUB12RG  14.04,50.99 0 top
HUB75RGB  14.04,33.21 0 top
HUB75RGB.  14.04,15.43 0 top
J1  105.48,14.35 0 top
J2  120.95,58.61 90 top
J3  82.62,24.32 180 bottom
J4  54.68,24.32 180 bottom
JP1  28.01,23.05 90 top
R1  110.62,26.86 270 top
R3  104.84,26.86 270 top
U2  99.45,58.93 0 top
U4  92.78,27.81 0 top
U8  41.34,27.5 90 top
U9  41.34,20.51 90 top

### Tracks (layer width: path | path; a pad name or v marks a point on that pad's centre or on a via)
3V3
  Top 0.305: J4.3V3A J4.3V3B
232_RX
  Top 0.203: J2.2 109.54,58.54 109.47,58.61 105.16,62.92 104.43,63.65 99.41,63.65 98.81,63.05 U2.13
232_TX
  Top 0.203: U2.14 97.54,63.37 98.18,64.01 106.84,64.01 J2.3
+3V3
  Top 1.016: U4.5 95.55,24.17 C19.1
+5V  (via drill 0.35)
  Top 0.152: U9.1 45.22,17.59 v45.79,17.02 | U9.20 37.15,17.59 v36.9,17.34 | U8.1 45.86,24.57 v46.11,24.32 | U8.20 37.28,24.57 v37.22,24.64
  Top 0.305: J4.5V_A J4.5V_B
  Top 1.016: C1.1 v108.66,42.73 | D1.2 v108.97,36.7 | U4.3 88.27,27.18 C17.1 87.57,26.48 v87.57,25.78
  pour Route15: 119.12,7.75 124.33,7.75 125.6,9.02 125.6,75.18 124.33,76.45 119.12,76.45 117.85,77.72 117.85,82.93 116.58,84.2 33.42,84.2 32.15,82.93 32.15,77.72 30.88,76.45 25.67,76.45 24.4,77.72 24.4,82.93 23.13,84.2 1.27,84.2 0,82.93 0,1.27 1.27,0 23.13,0 24.4,1.27 24.4,6.48 25.67,7.75 30.88,7.75 32.15,6.48 32.15,1.27 33.42,0 116.58,0 117.85,1.27 117.85,6.48
ADDRA_3V
  Top 0.152: 58.17,30.04 57.68,29.54 52.83,29.54 50.46,27.18 45.47,27.18
  Top 0.203: U8.5 45.47,27.17 45.47,27.18 | 58.17,30.04 58.81,30.67 J3.19B_B
  Top 0.305: J3.19A_A J3.19B_B
ADDRB_3V  (via drill 0.35)
  Top 0.203: U9.9 45.74,22.79 45.79,22.73 48.95,22.73 52.94,26.72 75.81,26.72 v75.95,26.86 | v78.49,43.05 78.81,43.37 81.98,43.37
  Top 0.305: J3.22A 81.98,43.37 J3.22B
  Bottom 0.203: v78.49,43.05 75.95,40.51 v75.95,26.86
ADDRC_3V
  Top 0.152: 57.86,31.94 57.69,31.78 51.68,31.78 47.72,27.81 45.47,27.81
  Top 0.203: U8.6 45.47,27.82 45.47,27.81 | 57.86,31.94 77.54,31.94 J3.21B
  Top 0.305: J3.21B J3.21A
ADDRD_3V
  Top 0.152: 45.47,26.54 51.19,26.54 52.3,27.66 52.3,28.59 52.95,29.23 58.01,29.23 58.17,29.4
  Top 0.203: U8.4 45.45,26.52 45.47,26.54 | J3.4B 80.22,19.1 80.22,26.06 81.16,27 84.36,27 85.02,27.66 85.02,28.6 84.22,29.4 58.17,29.4
  Top 0.305: J3.4A J3.4B
ADDRE_3V  (via drill 0.35)
  Top 0.152: J4.26A 49.92,22.1 v49.28,22.1 | v47.06,29.08 45.47,29.08
  Top 0.203: U8.8 45.44,29.12 45.47,29.08
  Top 0.305: J4.26A J4.26B
  Bottom 0.152: v49.28,22.1 47.38,24 47.38,29.08 v47.06,29.08
B1_3V  (via drill 0.35)
  Top 0.203: v51.5,19.56 51.48,19.54 U9.4
  Top 0.305: J4.33B J4.33A
  Bottom 0.203: J4.33A 51.5,28.77 v51.5,19.56
B2_3V
  Top 0.203: U9.7 45.77,21.49 45.79,21.46 50.22,21.46 52.94,24.18 77.4,24.18 J3.18B_B
  Top 0.305: J3.18B_B J3.18A_A
CAN1_RXD
  Top 0.203: J4.35A J4.35B 79.75,35.75 80.88,36.88 88.47,36.88 92.14,33.21 92.14,26.54 91.51,25.91 U4.4
CAN1_TXD
  Top 0.203: J3.5B J3.5A 85.48,27.18 85.48,29.4 86.43,30.35 89.38,30.35 U4.1
CAN_N
  Top 0.254: J1.5 106.75,21.97 D11.1 104.84,25.18 R3.2 103.58,27.18 103.58,28.77 104.21,29.4 105.16,29.4 107.7,31.94 107.7,33.21 106.11,34.8 101.12,34.8 99.85,33.53 99.85,30.24 96.79,27.18 U4.6
CAN_P
  Top 0.254: J1.6 108.65,21.34 D11.2 110.62,25.24 R1.2 111.83,27.12 111.83,28.77 110.88,29.72 110.33,29.72 108.11,31.94 108.11,33.38 106.28,35.2 100.96,35.2 99.45,33.7 99.45,31.11 96.79,28.45 U4.7
CLK_3V  (via drill 0.35)
  Top 0.203: U9.8 45.47,22.14 45.51,22.1 v48.33,22.1 | J3.2B 57.55,12.89 56.42,11.76 52.32,11.76 v49.6,14.48
  Top 0.305: J3.2A J3.2B
  Bottom 0.203: v49.6,14.48 48.33,15.75 v48.33,22.1
G1_3V
  Top 0.203: U9.3 51.78,18.89 J4.14A_A
  Top 0.305: J4.14A_A J4.14B_B
G2_3V
  Top 0.203: U9.5 45.78,20.19 45.79,20.19 50.87,20.19 53.41,22.73 J4.27A
  Top 0.305: J4.27B J4.27A
GND  (via drill 0.35)  (505 unrouted)
  Top 0.203: HUB75RGB..4 v7.69,21.78 | HUB75RGB..16 v22.93,21.78 | HUB08RG.1 v5.15,62.42 | HUB08RG.3 v7.69,62.42 | HUB08RG.5 v10.23,62.42 | HUB08RG.15 v22.93,62.42 | HUB08RG.13 v20.39,62.42 | HUB12RG.3 v7.69,44.64 | HUB12RG.15 v22.93,44.64 | HUB12RG.13 v20.39,44.64 | HUB12RG.11 v17.85,44.64 | HUB12RG.9 v15.31,44.64 | HUB12RG.7 v12.77,44.64 | HUB12RG.5 v10.23,44.64 | U2.15 96.27,63.88
  Top 0.508: C15.2 107.83,30.16 v107.83,31.11 | v106.94,26.67 106.94,26.13 D11.3 108.47,26.13 v108.47,26.67
  other vias: 105.16,53.21 97.86,64.96 61.03,25.59 61.03,23.05 67.38,23.05 67.38,25.59 67.38,28.13 77.54,28.13 73.73,28.13 63.57,33.21 63.57,37.02 1.34,82.74 2.61,82.74 3.88,82.74 5.15,82.74 6.42,82.74 7.69,82.74 8.96,82.74 10.23,82.74 11.5,82.74 12.77,82.74 14.04,82.74 15.31,82.74 16.58,82.74 17.85,82.74 22.93,82.74 21.66,82.74 20.39,82.74 19.12,82.74 33.09,82.74 34.36,82.74 35.63,82.74 36.9,82.74 38.17,82.74 39.44,82.74 40.71,82.74 41.98,82.74 43.25,82.74 44.52,82.74 45.79,82.74 47.06,82.74 48.33,82.74 49.6,82.74 1.34,81.47 1.34,80.2 1.34,78.93 1.34,77.66 1.34,76.39 1.34,75.12 60.65,30.04 64.46,30.04 69.54,30.04 74.62,30.04 77.16,30.04 48.33,25.59 45.79,25.59 48.33,24.32 35.63,25.59 36.9,25.59 34.36,25.59 5.15,25.59 5.15,26.86 7.69,26.86 7.69,25.59 10.23,25.59 10.23,26.86 12.77,26.86 10.23,24.32 10.23,23.05 12.77,22.29 15.31,22.29 17.85,22.29 20.14,21.91 48.97,27.88 66.11,33.21 68.65,33.21 71.19,33.21 73.73,33.21 77.54,33.21 78.81,31.94 50.11,29.15 51.89,30.92 51.38,29.78 48.84,30.42 50.87,32.32 51.89,32.83 57.47,31.05 57.6,28.38 57.98,25.84 64.84,37.02 92.78,44.64 92.78,43.37 92.78,42.1 92.78,40.83 94.05,40.83 99.13,40.83 99.13,42.1 99.13,43.37 99.13,44.64 97.86,44.64 96.59,44.64 95.32,44.64 94.05,44.64 95.32,40.83 96.59,40.83 97.86,40.83 115.64,34.48 115.64,35.75 115.64,37.02 115.64,38.29 115.64,39.56 116.91,39.56 118.18,39.56 119.45,39.56 120.72,39.56 120.72,38.29 120.72,37.02 120.72,35.75 120.72,34.48 120.72,33.21 119.45,33.21 118.18,33.21 116.91,33.21 115.64,33.21 50.87,82.74 52.14,82.74 53.41,82.74 54.68,82.74 55.95,82.74 57.22,82.74 58.49,82.74 59.76,82.74 61.03,82.74 62.3,82.74 63.57,82.74 64.84,82.74 66.11,82.74 67.38,82.74 86.43,82.74 87.7,82.74 88.97,82.74 90.24,82.74 91.51,82.74 92.78,82.74 94.05,82.74 95.32,82.74 96.59,82.74 97.86,82.74 99.13,82.74 100.4,82.74 101.67,82.74 102.94,82.74 68.65,82.74 69.92,82.74 71.19,82.74 72.46,82.74 73.73,82.74 75,82.74 76.27,82.74 77.54,82.74 78.81,82.74 80.08,82.74 81.35,82.74 82.62,82.74 83.89,82.74 85.16,82.74 104.21,82.74 105.48,82.74 106.75,82.74 108.02,82.74 109.29,82.74 110.56,82.74 111.83,82.74 113.1,82.74 114.37,82.74 115.64,82.74 116.91,82.74 22.93,81.47 22.93,80.2 22.93,78.93 22.93,77.66 22.93,76.39 33.09,81.47 33.09,80.2 33.09,78.93 33.09,77.66 33.09,76.39 33.09,75.12 31.82,75.12 30.55,75.12 29.28,75.12 28.01,75.12 26.74,75.12 25.47,75.12 24.2,75.12 22.93,75.12 28.01,9.08 29.28,9.08 30.55,9.08 31.82,9.08 33.09,9.08 33.09,7.81 33.09,6.54 33.09,5.27 22.93,6.54 22.93,7.81 22.93,9.08 24.2,9.08 25.47,9.08 26.74,9.08 22.93,5.27 22.93,4 22.93,2.73 22.93,1.46 21.66,1.46 20.39,1.46 33.09,1.46 34.36,1.46 35.63,1.46 33.09,2.73 33.09,4 4.9,21.4 4.9,23.3 6.42,12.89 11.5,12.89 16.58,12.89 19.12,12.89 21.66,12.89 24.2,12.89 3.88,12.89 8.96,12.89 14.04,12.89 19.12,1.46 17.85,1.46 1.34,1.46 1.34,2.73 1.34,4 1.34,5.27 36.9,1.46 38.17,1.46 39.44,1.46 40.71,1.46 41.98,1.46 43.25,1.46 44.52,1.46 45.79,1.46 47.06,1.46 48.33,1.46 49.6,1.46 50.87,1.46 52.14,1.46 54.68,1.46 57.22,1.46 58.49,1.46 59.76,1.46 61.03,1.46 62.3,1.46 63.57,1.46 64.84,1.46 66.11,1.46 67.38,1.46 86.43,1.46 87.7,1.46 88.97,1.46 90.24,1.46 91.51,1.46 92.78,1.46 94.05,1.46 95.32,1.46 96.59,1.46 97.86,1.46 99.13,1.46 100.4,1.46 101.67,1.46 102.94,1.46 68.65,1.46 69.92,1.46 71.19,1.46 72.46,1.46 73.73,1.46 75,1.46 76.27,1.46 77.54,1.46 78.81,1.46 80.08,1.46 82.62,1.46 85.16,1.46 104.21,1.46 105.48,1.46 106.75,1.46 108.02,1.46 109.29,1.46 110.56,1.46 111.83,1.46 113.1,1.46 114.37,1.46 115.64,1.46 16.58,1.46 15.31,1.46 14.04,1.46 12.77,1.46 2.61,1.46 3.88,1.46 1.34,6.54 1.34,7.81 1.34,9.08 1.34,10.35 1.34,11.62 1.34,12.89 1.34,14.16 1.34,15.43 1.34,16.7 1.34,17.97 1.34,19.24 1.34,20.51 1.34,21.78 1.34,23.05 1.34,24.32 1.34,25.59 1.34,44.64 1.34,45.91 1.34,47.18 1.34,48.45 1.34,49.72 1.34,50.99 1.34,52.26 1.34,53.53 1.34,54.8 1.34,56.07 1.34,57.34 1.34,58.61 1.34,59.88 1.34,61.15 1.34,26.86 1.34,28.13 1.34,29.4 1.34,30.67 1.34,31.94 1.34,33.21 1.34,34.48 1.34,35.75 1.34,37.02 1.34,38.29 1.34,39.56 1.34,40.83 1.34,42.1 1.34,43.37 1.34,62.42 1.34,63.69 1.34,64.96 1.34,66.23 1.34,67.5 1.34,68.77 1.34,70.04 1.34,71.31 1.34,72.58 1.34,73.85 11.5,1.46 10.23,1.46 8.96,1.46 7.69,1.46 6.42,1.46 5.15,1.46 118.18,9.08 119.45,9.08 120.72,9.08 121.99,9.08 123.26,9.08 116.91,2.73 116.91,1.46 116.91,4 116.91,9.08 124.53,9.08 124.53,10.35 124.53,11.62 124.53,12.89 124.53,14.16 124.53,15.43 124.53,16.7 124.53,17.97 124.53,19.24 124.53,20.51 124.53,21.78 124.53,23.05 124.53,24.32 124.53,25.59 124.53,26.86 124.53,28.13 124.53,29.4 124.53,30.67 124.53,49.72 124.53,50.99 124.53,52.26 124.53,53.53 124.53,54.8 124.53,56.07 124.53,57.34 124.53,58.61 124.53,59.88 124.53,61.15 124.53,62.42 124.53,63.69 124.53,64.96 124.53,66.23 124.53,31.94 124.53,33.21 124.53,34.48 124.53,35.75 124.53,37.02 124.53,38.29 124.53,39.56 124.53,40.83 124.53,42.1 124.53,43.37 124.53,44.64 124.53,45.91 124.53,47.18 124.53,48.45 124.53,67.5 124.53,68.77 124.53,70.04 124.53,71.31 124.53,72.58 124.53,73.85 124.53,75.12 116.91,81.47 123.26,75.12 121.99,75.12 120.72,75.12 116.91,80.2 116.91,78.93 116.91,77.66 116.91,76.39 116.91,75.12 118.18,75.12 119.45,75.12 95.32,31.94 96.59,31.94 91.51,28.13 91.51,29.4 87.7,31.94 86.43,29.4 86.43,28.13 91.51,24.32 91.51,23.05 92.78,21.78 91.51,21.78 8.3,42.1 10.23,42.1 10.2,39.23 12.41,39.2 7.66,39.2 29.28,25.59 31.54,26.45 26.61,26.1 20.26,27.37 106.45,63.03 105.43,65.32 105.4,61.2 92.7,57.39 96.51,66.28 38.17,81.47
  pour Bottom: 119.12,7.75 124.33,7.75 125.6,9.02 125.6,75.18 124.33,76.45 119.12,76.45 117.85,77.72 117.85,82.93 116.58,84.2 33.42,84.2 32.15,82.93 32.15,77.72 30.88,76.45 25.67,76.45 24.4,77.72 24.4,82.93 23.13,84.2 1.27,84.2 0,82.93 0,1.27 1.27,0 23.13,0 24.4,1.27 24.4,6.48 25.67,7.75 30.88,7.75 32.15,6.48 32.15,1.27 33.42,0 116.58,0 117.85,1.27 117.85,6.48
  pour Top: 119.12,7.75 124.33,7.75 125.6,9.02 125.6,75.18 124.33,76.45 119.12,76.45 117.85,77.72 117.85,82.93 116.58,84.2 33.42,84.2 32.15,82.93 32.15,77.72 30.88,76.45 25.67,76.45 24.4,77.72 24.4,82.93 23.13,84.2 1.27,84.2 0,82.93 0,1.27 1.27,0 23.13,0 24.4,1.27 24.4,6.48 25.67,7.75 30.88,7.75 32.15,6.48 32.15,1.27 33.42,0 116.58,0 117.85,1.27 117.85,6.48
  pour Route2: 119.12,7.75 124.33,7.75 125.6,9.02 125.6,75.18 124.33,76.45 119.12,76.45 117.85,77.72 117.85,82.93 116.58,84.2 33.42,84.2 32.15,82.93 32.15,77.72 30.88,76.45 25.67,76.45 24.4,77.72 24.4,82.93 23.13,84.2 1.27,84.2 0,82.93 0,1.27 1.27,0 23.13,0 24.4,1.27 24.4,6.48 25.67,7.75 30.88,7.75 32.15,6.48 32.15,1.27 33.42,0 116.58,0 117.85,1.27 117.85,6.48
LAT_3V  (via drill 0.35)
  Top 0.152: 45.47,28.45 47.92,28.45 51.56,32.08 57.44,32.08 57.73,32.37 58.29,32.37 v59.44,33.53 | J3.15B_B v77.86,10.35
  Top 0.203: U8.7 45.45,28.47 45.47,28.45
  Top 0.305: J3.15B_B J3.15A_A
  Bottom 0.152: v77.86,10.35 59.44,28.77 v59.44,33.53
M1_A  (via drill 0.35)
  Top 0.152: HUB75RGB..9 16.26,13.51 16.26,26.86 | 16.26,26.86 16.26,29.38 HUB75RGB.9 16.26,31.29 v16.26,40.51 | U8.15 v35.95,27.82 v35.95,27.81 | v15.31,26.86 16.26,26.86 | HUB08RG.2 4.2,70.69 4.2,54.82 HUB12RG.2 4.2,52.91 v4.2,43.69
  Bottom 0.152: v15.31,26.86 17.31,26.86 17.6,26.57 24.86,26.57 26.1,27.81 v35.95,27.81 | v4.2,43.69 6.71,41.18 15.6,41.18 v16.26,40.51
M1_B  (via drill 0.35)
  Top 0.152: HUB75RGB..10 14.36,19.26 14.36,24.96 | 14.36,24.96 14.36,35.13 HUB75RGB.10 14.36,37.04 v14.36,39.56 | U9.11 37.15,23.44 36.27,24.32 v35.95,24.32 | v15.31,24.96 14.36,24.96 | HUB08RG.4 6.74,70.69 6.74,54.82 HUB12RG.4 6.74,52.91 6.74,43.37 v7.37,42.73
  Bottom 0.152: v35.95,24.32 15.95,24.32 v15.31,24.96 | v7.37,42.73 7.28,42.73 5.72,44.29 3.95,44.29 3.59,43.94 3.59,43.44 6.2,40.83 13.09,40.83 v14.36,39.56
M1_B1  (via drill 0.35)
  Top 0.152: U9.16 v36.59,20.19 v36.58,20.19 | v8.01,24.64 6.79,24.64
  Top 0.203: HUB75RGB..3 6.79,13.46 6.79,24.64 6.79,29.43 HUB75RGB.3
  Bottom 0.152: v36.58,20.19 8.42,20.19 7.08,21.53 7.08,22.67 8.01,23.59 v8.01,24.64
M1_B2  (via drill 0.35)
  Top 0.152: HUB75RGB..7 11.82,13.51 11.82,23.69 | HUB75RGB.7 11.82,29.38 11.82,23.69 | U9.13 38.39,22.1 36.27,22.1 34.68,23.69 v33.73,23.69 | v12.77,23.69 11.82,23.69
  Bottom 0.152: v33.73,23.69 v12.77,23.69
M1_C  (via drill 0.35)
  Top 0.152: HUB75RGB..11 18.8,13.51 18.8,27.18 | 18.8,27.18 18.8,29.38 HUB75RGB.11 18.8,31.29 18.8,39.56 16.9,41.47 13.31,41.47 11.43,43.34 9.62,43.34 9.28,43.69 9.28,52.91 HUB12RG.6 9.28,54.82 9.28,70.69 HUB08RG.6 | U8.14 38.41,28.45 v36.9,28.45 | v17.85,27.18 18.8,27.18
  Bottom 0.152: v36.9,28.45 19.12,28.45 v17.85,27.18
M1_CLK  (via drill 0.35)
  Top 0.152: HUB75RGB..13 21.34,13.51 21.34,22.79 | 21.34,22.79 21.34,29.38 HUB75RGB.13 21.34,31.29 21.34,39.56 19.13,41.77 15.64,41.77 13.72,43.69 13.72,52.91 HUB12RG.8 13.72,54.82 v13.72,57.66 | U9.12 v36.9,22.79 | v20.71,22.79 21.34,22.79 | HUB08RG.16 21.98,70.69 21.98,61.78 v21.66,61.47
  Bottom 0.152: v36.9,22.79 v20.71,22.79 | v21.66,61.47 20.71,60.52 18.17,60.52 16.87,59.22 16.87,58.04 16.51,57.69 14.7,57.69 14.67,57.66 v13.72,57.66
M1_D  (via drill 0.35)
  Top 0.152: HUB75RGB..12 16.9,19.26 16.9,25.59 | 16.9,25.59 16.9,35.13 HUB75RGB.12 16.9,37.04 16.9,39.88 v16.91,39.87 | U8.16 v36.91,27.17 v36.9,27.18 | v17.85,25.59 16.9,25.59 | HUB08RG.8 13.72,70.69 13.72,60.52 15.31,58.93 22.61,58.93 23.88,57.66 23.88,54.82 HUB12RG.16 23.88,52.91 v23.88,43.05
  Bottom 0.152: v36.9,27.18 26.74,27.18 25.16,25.6 21.42,25.6 21.11,25.92 20.31,25.92 19.99,25.6 18.29,25.6 18.28,25.59 v17.85,25.59 | v16.91,39.87 18.27,39.87 19.19,38.95 21.71,38.95 22.89,40.13 22.89,42.06 v23.88,43.05
M1_E  (via drill 0.35)
  Top 0.152: JP1.2 v28.01,25.91
  Top 0.203: HUB75RGB..8 13.72,19.26 13.72,25.59 | HUB75RGB.8 13.72,35.13 13.72,25.59 | v12.77,25.59 13.72,25.59
  Bottom 0.203: v28.01,25.91 27.38,25.27 21.28,25.27 20.97,25.59 20.45,25.59 20.13,25.27 18.43,25.27 18.11,24.96 16.2,24.96 15.57,25.59 v12.77,25.59
M1_E_NC
  Top 0.203: U8.12 38.18,29.53 36.24,29.53 32.3,25.59 30.61,25.59 30.23,25.22 30.23,24.69 30.55,24.38 30.55,23.05 29.28,21.78 JP1.1
M1_G1  (via drill 0.35)
  Top 0.152: U9.17 38.41,19.56 v35.31,19.56 | v5.47,24.26 4.2,24.26 | HUB08RG.10 14.36,70.69 14.36,60.83 15.63,59.56 v19.12,59.56 | HUB75RGB.2 4.2,37.04 v4.2,39.56 | v21.34,58.29 21.34,54.82 HUB12RG.14 21.34,52.91 21.34,43.37 21.66,43.05 v22.61,43.05
  Top 0.203: HUB75RGB..2 4.2,19.26 4.2,24.26 4.2,35.13 HUB75RGB.2
  Bottom 0.152: v5.47,24.26 6.78,22.95 6.78,21.4 8.62,19.56 v35.31,19.56 | v19.12,59.56 20.07,59.56 v21.34,58.29 | v22.61,43.05 23.02,43.05 23.63,43.66 24.13,43.66 24.49,43.3 24.49,41.3 21.83,38.65 14.41,38.65 12.58,40.48 6.17,40.48 5.24,39.56 v4.2,39.56
M1_G2  (via drill 0.35)
  Top 0.152: HUB75RGB..6 9.28,19.26 9.28,23.05 | 9.28,23.05 9.28,35.13 HUB75RGB.6 9.28,37.04 v9.28,42.73 | U9.15 v35.31,20.83 | v8.33,23.05 9.28,23.05 | HUB08RG.12 16.9,70.69 v16.9,62.42
  Bottom 0.152: v8.33,23.05 8.35,23.02 8.35,22.16 9.69,20.83 v35.31,20.83 | v16.9,62.42 16.9,61.78 16.58,61.47 12.68,61.47 11.42,60.21 10.24,60.21 9.28,59.25 v9.28,42.73
M1_LAT  (via drill 0.35)
  Top 0.152: HUB75RGB..14 19.44,19.26 19.44,24.96 | 19.44,24.96 19.44,35.13 HUB75RGB.14 19.44,37.04 v19.44,39.56 | HUB08RG.14 19.44,70.69 19.44,61.78 v19.45,61.78 | U8.13 36.3,29.12 32.14,24.96 v30.87,24.96 | v20.71,24.96 19.44,24.96 | v16.26,58.29 16.26,54.82 HUB12RG.10 16.26,52.91 v16.26,43.05
  Bottom 0.152: v19.45,61.78 18.5,60.83 16.9,60.83 16.26,60.2 v16.26,58.29 | v16.26,43.05 17.53,41.79 21.56,41.79 22.58,40.76 22.58,40.26 22.23,39.91 19.78,39.91 v19.44,39.56 | v30.87,24.96 28.79,24.96 28.78,24.94 21.15,24.94 21.13,24.96 v20.71,24.96
M1_OE  (via drill 0.35)
  Top 0.152: HUB75RGB..15 21.98,13.51 21.98,27.51 | 21.98,27.51 21.98,29.38 HUB75RGB.15 21.98,31.29 v21.98,40.51 | HUB08RG.7 11.82,64.94 v11.82,61.47 | U8.11 36.33,30.42 33.42,27.51 21.98,27.51 | v6.1,59.56 6.1,49.07 HUB12RG.1 6.1,47.16 v6.1,43.05
  Bottom 0.152: v11.82,61.47 10.86,60.52 7.06,60.52 v6.1,59.56 | v6.1,43.05 7.67,41.48 21.33,41.48 21.98,40.83 v21.98,40.51
M1_R1  (via drill 0.35)
  Top 0.152: U9.18 38.39,18.92 v36.9,18.92 | v5.15,22.42 6.1,22.42 | HUB08RG.9 16.26,64.94 16.26,60.83 16.93,60.17 19.37,60.17 19.66,59.88 v20.71,59.88 | HUB75RGB.1 6.1,31.29 6.1,39.56 v6.42,39.88 | v18.8,57.34 18.8,54.82 HUB12RG.12 18.8,52.91 18.8,43.37 19.12,43.05 v19.76,43.05
  Top 0.203: HUB75RGB..1 6.1,13.51 6.1,22.42 6.1,29.38 HUB75RGB.1
  Bottom 0.152: v36.9,18.92 8.64,18.92 v5.15,22.42 | v20.71,59.88 20.71,59.79 21.95,58.54 21.95,58.04 21.59,57.69 19.15,57.69 v18.8,57.34 | v19.76,43.05 21.75,43.05 22.67,43.96 24.26,43.96 24.79,43.43 24.79,41.18 21.96,38.34 14.28,38.34 12.75,39.88 v6.42,39.88
M1_R2  (via drill 0.35)
  Top 0.152: HUB75RGB..5 11.18,13.51 11.18,21.46 | 11.18,21.46 11.18,29.38 HUB75RGB.5 11.18,31.29 v11.18,42.73 | U9.14 38.41,21.46 v36.27,21.46 | v10.23,21.46 11.18,21.46 | HUB08RG.11 18.8,64.94 v18.8,62.42
  Bottom 0.152: v36.27,21.46 23.47,21.46 23.18,21.17 12.52,21.17 12.23,21.46 v10.23,21.46 | v18.8,62.42 17.53,61.15 13.09,61.15 11.18,59.25 v11.18,42.73
MOUNT1  (via drill 3.2 pad 7)
  other vias: 121.85,80.45
MOUNT2  (via drill 3.2 pad 7)
  other vias: 121.85,3.75
MOUNT3  (via drill 3.2 pad 7)
  other vias: 28.15,80.45
MOUNT4  (via drill 3.2 pad 7)
  other vias: 28.15,3.75
N$1
  Top 0.305: J3.0B J3.0A
N$2
  Top 0.305: J4.CMD_B J4.CMD_A
N$3
  Top 0.305: J4.D3_A J4.D3_B
N$5
  Top 0.305: J4.D2A J4.D2B
N$6
  Top 0.305: J3.CLKB J3.CLKA
N$7
  Top 0.305: J3.D0A J3.D0B
N$8
  Top 0.305: J3.D1B J3.D1A
N$9
  Top 0.305: J4.VNA J4.VNB
N$10
  Top 0.305: J4.VPB J4.VPA
N$11
  Top 0.305: J4.34A J4.34B
N$13
  Top 0.305: J4.ENA J4.ENB
N$14
  Top 0.305: J3.TXB J3.TXA
N$15
  Top 0.305: J3.RXA J3.RXB
N$16
  Top 0.305: J3.17B_B J3.17A_A
N$17
  Top 0.305: J3.16_B J3.16A_A
N$20
  Top 0.254: R3.1 105.17,28.13 C15.1 110.3,28.13 R1.1
N$33
  Top 0.406: C6.2 U2.1
N$34
  Top 0.406: U2.3 97.54,53.79 C6.1
N$35
  Top 0.406: U2.4 98.81,53.53 C7.2
N$36
  Top 0.406: U2.5 100.08,53.53 C7.1
N$37
  Top 0.254: U2.2 96.27,57.85 95.48,58.64 95.19,58.93 C4.1
N$38
  Top 0.406: U2.6 101.35,53.79 C8.1
OE_3V  (via drill 0.35)
  Top 0.203: v47.06,30.99 45.84,29.77 U8.9
  Top 0.305: J4.13A_A J4.13B_B
  Bottom 0.203: J4.13A_A 50.23,16.07 50.23,27.81 v47.06,30.99
R1_3V
  Top 0.203: J4.12A 53.14,18.24 U9.2
  Top 0.305: J4.12B J4.12A
R2_3V  (via drill 0.35)
  Top 0.203: U9.6 45.78,20.84 45.79,20.83 49.28,20.83 49.59,20.83 50.55,20.83 v50.87,21.15
  Top 0.305: J4.25B J4.25A
  Bottom 0.203: J4.25A 53.41,27.19 54.54,26.06 54.54,25.12 53.6,24.18 52.94,24.18 52.14,23.38 52.14,19.3 51.77,18.93 51.24,18.93 50.87,19.3 v50.87,21.14 v50.87,21.15
RX  (via drill 0.35)
  Top 0.203: J4.32A J4.32B | v100.08,59.56 U2.12
  Bottom 0.203: J4.32B 72.47,49.73 77.17,49.73 87,59.56 v100.08,59.56
TX  (via drill 0.35)
  Top 0.203: J3.23B J3.23A | v101.03,58.29 101.03,61.41 U2.11
  Bottom 0.203: J3.23A 96.27,58.29 v101.03,58.29
VCC
  Top 0.203: 94.88,61.86 U2.16
  Top 0.406: C4.2 94,61.73 U2.16 | C3.1 94.88,63.82 94.88,61.86

### Text on the board
tPlace: HUB08 / RG | HUB12 / RG | HUB75 / RGB | HUB75 / RGB
tNames: A | B | C | D | G0 | G1 | LT | CK | OE | R0 | R1 | A | B | C | LT | R1 | G1 | D | OE | G0 | G1 | B | D | LT | R0 | B0 | R1 | B1 | A | C | CK | OE | G0 | G1 | B | D | LT | R0 | B0 | R1 | B1 | A | C | CK | OE | OE
214bmp: D:/SmartProjects/Snc/a4_bn_logo2.bmp